# Altium schematic sheet Power.SchDoc
size C; SheetNumber: 3; SheetTotal: 15
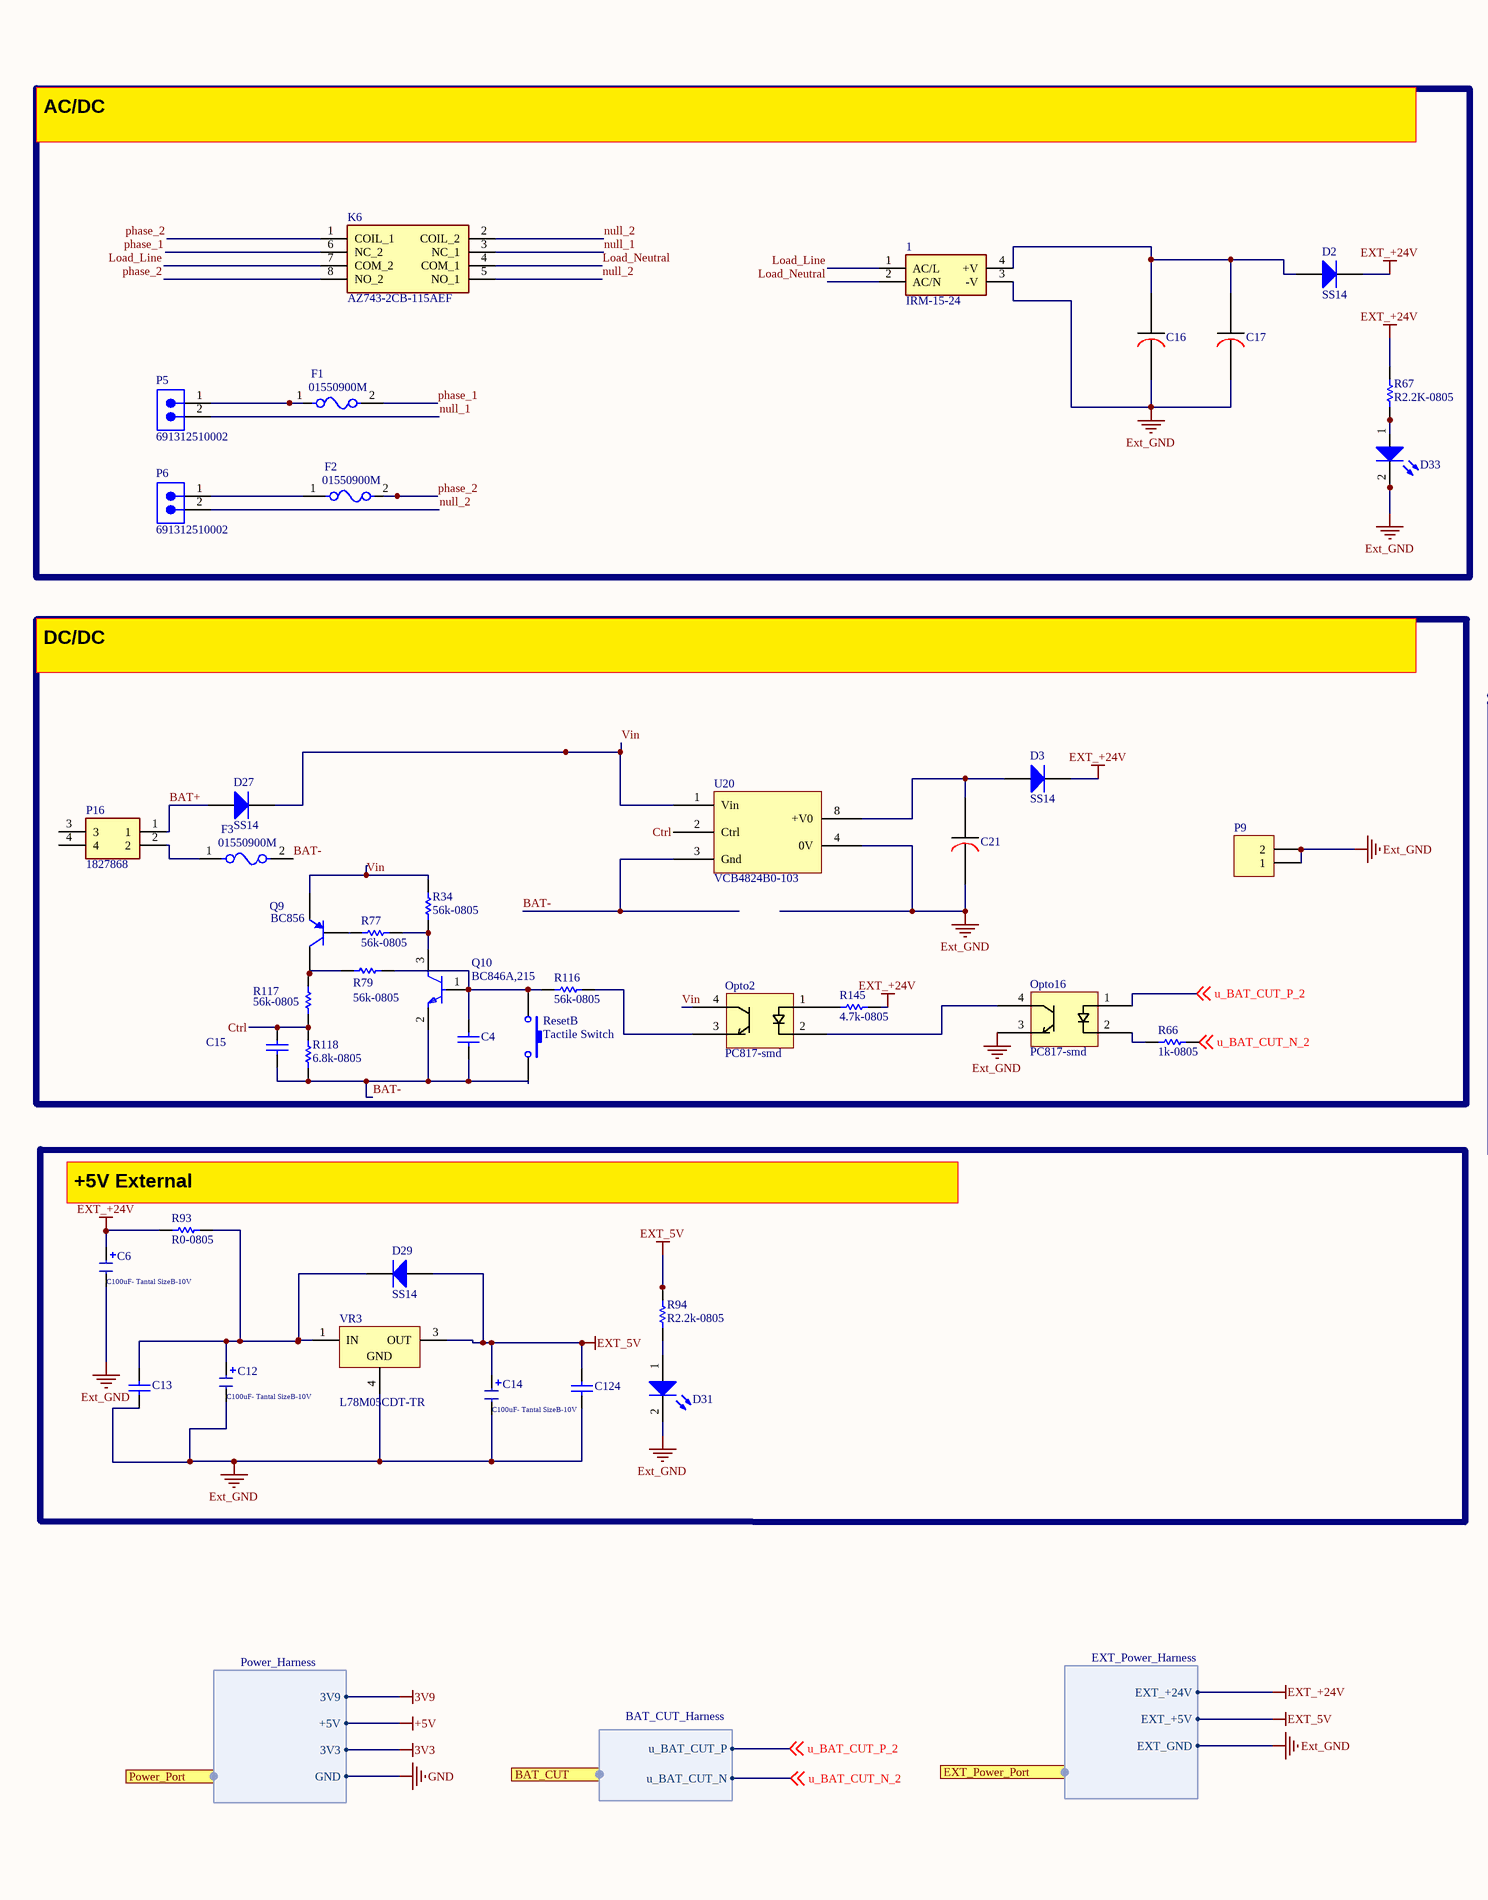
[diagram p0: Power.SchDoc, left]
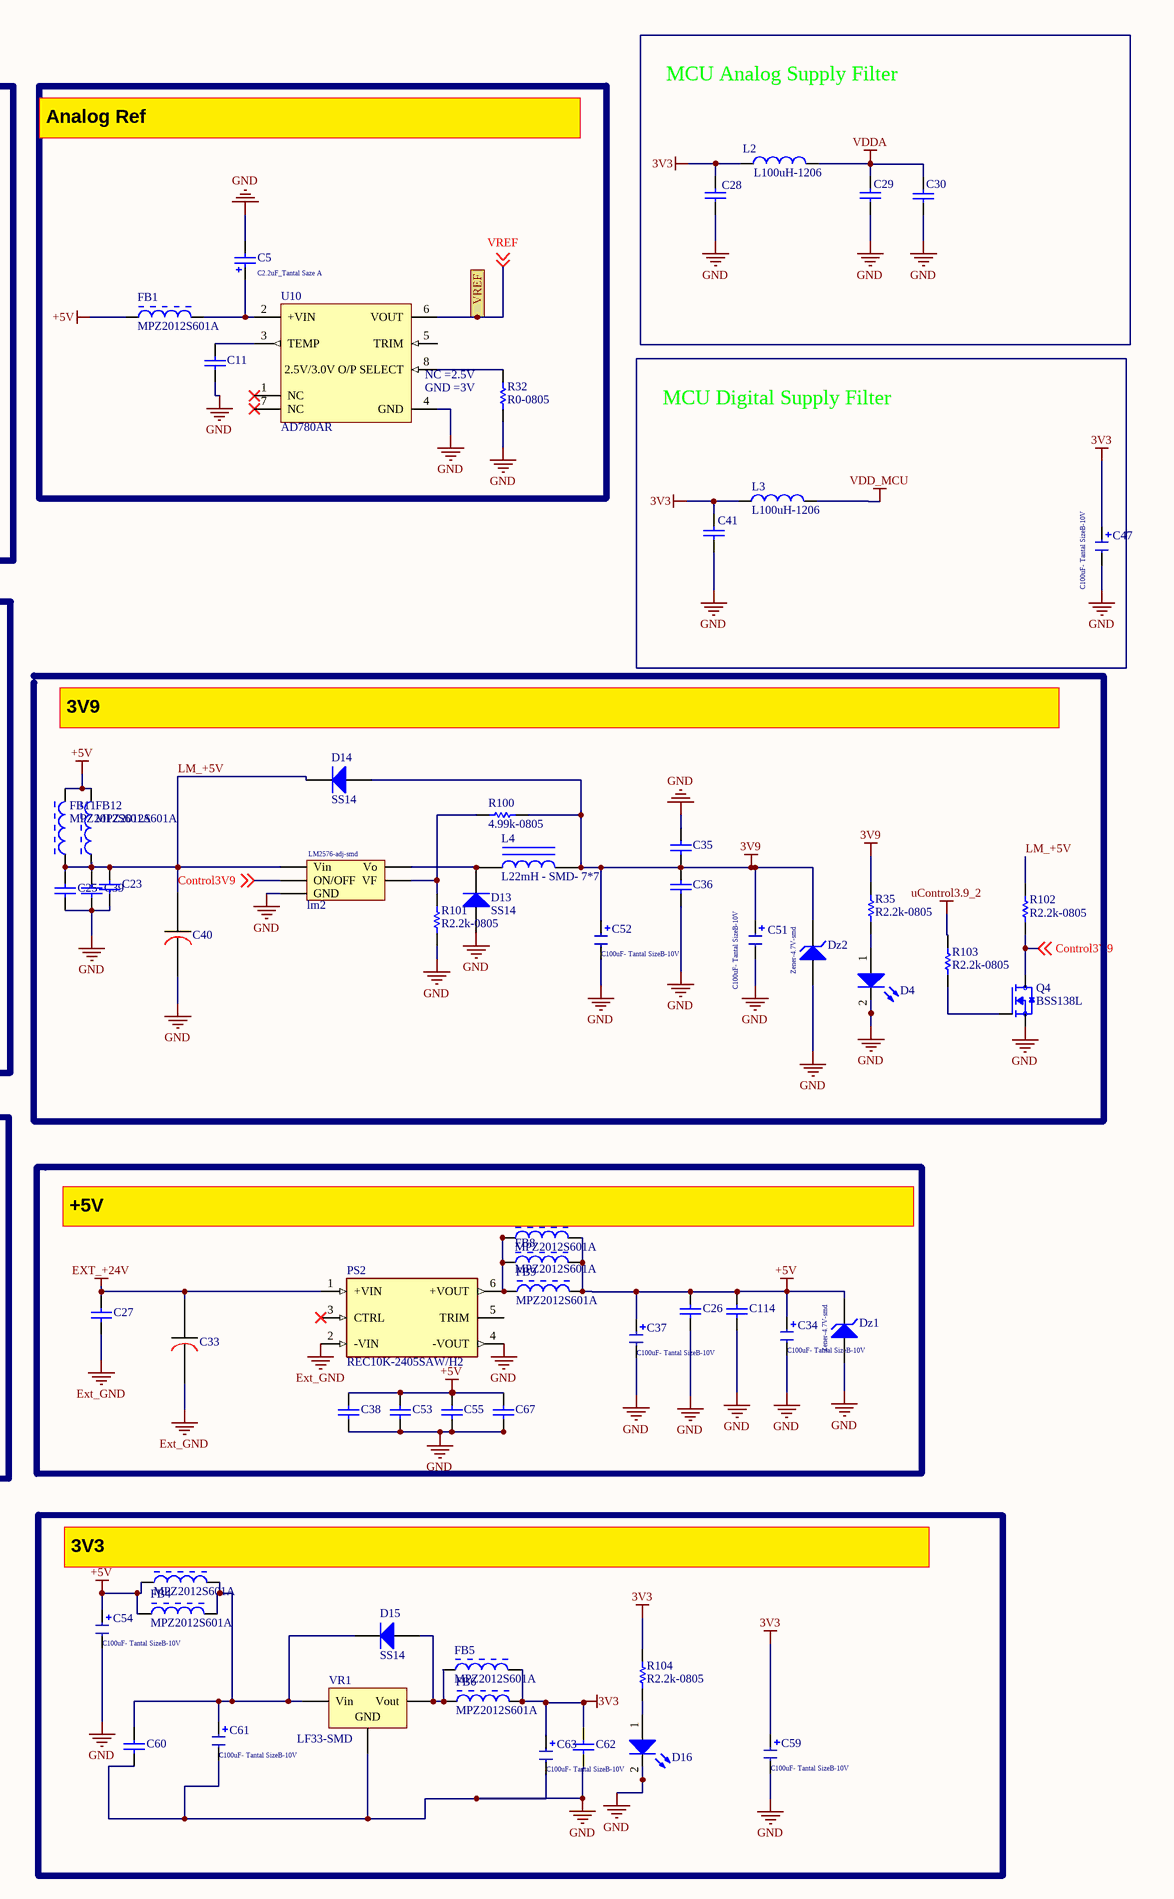
[diagram p1: Power.SchDoc, right]

## Parts
1  IRM-15-24  [IRM-15-5]
C4  (no value)  [CRF06031]
C5  C2.2uF_Tantal Saze A  [Tantalium Size A]
C6  C100uF- Tantal SizeB-10V  [Tantalium Size B]
C11  (no value)  [CRF06031]
C12  C100uF- Tantal SizeB-10V  [Tantalium Size B]
C13  (no value)  [CRF06031]
C14  C100uF- Tantal SizeB-10V  [Tantalium Size B]
C15  (no value)  [CRF06031]
C16  C100uF-50V  [CAPACITOR RADIAL SMT size F]  (value not drawn)
C17  C100uF-50V  [CAPACITOR RADIAL SMT size F]  (value not drawn)
C21  C100uF-50V  [CAPACITOR RADIAL SMT size F]  (value not drawn)
C23  (no value)  [CRF06031]
C25  (no value)  [CRF06031]
C26  (no value)  [CRF06031]
C27  (no value)  [CRF06031]
C28  (no value)  [CRF06031]
C29  (no value)  [CRF06031]
C30  (no value)  [CRF06031]
C33  C100uF-50V  [CAPACITOR RADIAL SMT size F]  (value not drawn)
C34  C100uF- Tantal SizeB-10V  [Tantalium Size B]
C35  (no value)  [CRF06031]
C36  (no value)  [CRF06031]
C37  C100uF- Tantal SizeB-10V  [Tantalium Size B]
C38  (no value)  [CRF06031]
C39  (no value)  [CRF06031]
C40  C100uF-50V  [CAPACITOR RADIAL SMT size F]  (value not drawn)
C41  (no value)  [CRF06031]
C47  C100uF- Tantal SizeB-10V  [Tantalium Size B]
C51  C100uF- Tantal SizeB-10V  [Tantalium Size B]
C52  C100uF- Tantal SizeB-10V  [Tantalium Size B]
C53  (no value)  [CRF06031]
C54  C100uF- Tantal SizeB-10V  [Tantalium Size B]
C55  (no value)  [CRF06031]
C59  C100uF- Tantal SizeB-10V  [Tantalium Size B]
C60  (no value)  [CRF06031]
C61  C100uF- Tantal SizeB-10V  [Tantalium Size B]
C62  (no value)  [CRF06031]
C63  C100uF- Tantal SizeB-10V  [Tantalium Size B]
C67  (no value)  [CRF06031]
C114  (no value)  [CRF06031]
C124  (no value)  [CRF06031]
D2  SS14  [ind]
D3  SS14  [ind]
D4  LED_0805_green  [0805-LED]  (value not drawn)
D13  SS14  [ind]
D14  SS14  [ind]
D15  SS14  [ind]
D16  LED_0805_green  [0805-LED]  (value not drawn)
D27  SS14  [ind]
D29  SS14  [ind]
D31  LED_0805_green  [0805-LED]  (value not drawn)
D33  LED_0805_green  [0805-LED]  (value not drawn)
Dz1  Zener-4.7V-smd  [ind]
Dz2  Zener-4.7V-smd  [ind]
F1  01550900M  [FP-0155-MFG]
F2  01550900M  [FP-0155-MFG]
F3  01550900M  [FP-0155-MFG]
FB1  MPZ2012S601A  [TDK-MPZ2012_V]
FB3  MPZ2012S601A  [TDK-MPZ2012_V]
FB4  MPZ2012S601A  [TDK-MPZ2012_V]
FB5  MPZ2012S601A  [TDK-MPZ2012_V]
FB6  MPZ2012S601A  [TDK-MPZ2012_V]
FB7  MPZ2012S601A  [TDK-MPZ2012_V]
FB8  MPZ2012S601A  [TDK-MPZ2012_V]
FB9  MPZ2012S601A  [TDK-MPZ2012_V]
FB11  MPZ2012S601A  [TDK-MPZ2012_V]
FB12  MPZ2012S601A  [TDK-MPZ2012_V]
K6  AZ743-2CB-115AEF  [AZ7432CB115AEF]
L2  L100uH-1206  [crf1206]
L3  L100uH-1206  [crf1206]
L4  L22mH - SMD- 7*7  [LM_810]
lm2  LM2576-adj-smd  [lm2576 - SMD]
Opto2  PC817-smd  [PC817_SMD1]
Opto16  PC817-smd  [PC817_SMD1]
P5  691312510002  [691312510002]
P6  691312510002  [691312510002]
P9  DNP  [HDR1X2]  (value not drawn)
P16  1827868  [1827868]
PS2  REC10K-2405SAW/H2  [CONV_REC10K-2405SAW/H2]
Q4  BSS138L  [BSS138L]
Q9  BC856  [NXP-SOT23-3_V]
Q10  BC846A,215  [FP-SOT23-MFG]
R32  R0-0805  [CRF06031]
R34  56k-0805  [CRF06031]
R35  R2.2k-0805  [CRF06031]
R66  1k-0805  [CRF06031]
R67  R2.2K-0805  [CRF06031]
R77  56k-0805  [CRF06031]
R79  56k-0805  [CRF06031]
R93  R0-0805  [CRF06031]
R94  R2.2k-0805  [CRF06031]
R100  4.99k-0805  [CRF06031]
R101  R2.2k-0805  [CRF06031]
R102  R2.2k-0805  [CRF06031]
R103  R2.2k-0805  [CRF06031]
R104  R2.2k-0805  [CRF06031]
R116  56k-0805  [CRF06031]
R117  56k-0805  [CRF06031]
R118  6.8k-0805  [CRF06031]
R145  4.7k-0805  [CRF06031]
ResetB  Tactile Switch  [CRF06031]
U10  AD780AR  [SOIC-8]
U20  VCB4824B0-103  [VCB4824SB0-10WR3]
VR1  LF33-SMD  [LM7805 - smd]
VR3  L78M05CDT-TR  [TO-252_L]

## Ports
BAT_CUT (harness BAT_CUT_Harness), EXT_Power_Port (harness EXT_Power_Harness), Power_Port (harness Power_Harness), VREF

## Harnesses
Power_Harness: 3V9, +5V, 3V3, GND
BAT_CUT_Harness: u_BAT_CUT_P, u_BAT_CUT_N
EXT_Power_Harness: EXT_+24V, EXT_+5V, EXT_GND

## Nets
3V3: C28.1 C41.1 C47.1 C59.1 C62.1 C63.1 FB5.2 FB6.2 L2.1 L3.1 R104.1 ; port Power_Port.3V3
3V9: C35.2 C36.2 C51.1 C52.1 D14.1(A) Dz2.2(K) L4.2 R35.1 R100.1 ; port Power_Port.3V9
+5V: C26.2 C34.1 C37.1 C38.1 C53.1 C54.1 C55.1 C67.1 C114.2 Dz1.2(K) FB1.1 FB3.1 FB4.1 FB7.2 FB8.2 FB9.2 FB11.2 FB12.2 ; port Power_Port.+5V
EXT_5V: C14.1 C124.1 D29.1(A) R94.1 VR3.3(OUT) ; port EXT_Power_Port.EXT_+5V
EXT_+24V: C6.1 C27.2 C33.1 D2.2(K) D3.2(K) PS2.1(+VIN) R67.1 R93.1 R145.1 ; port EXT_Power_Port.EXT_+24V
Ext_GND: 1.3(-V) C6.2 C12.2 C13.2 C14.2 C16.2 C17.2 C21.2 C27.1 C33.2 C124.2 D31.2(K) D33.2(K) Opto16.3 P9.1 P9.2 PS2.2(-VIN) U20.4(0V) VR3.4(GND) ; port EXT_Power_Port.EXT_GND
GND: C5.2 C11.2 C23.1 C25.1 C26.1 C28.2 C29.2 C30.2 C34.2 C35.1 C36.1 C37.2 C38.2 C39.1 C40.2 C41.2 C47.2 C51.2 C52.2 C53.2 C54.2 C55.2 C59.2 C60.2 C61.2 C62.2 C63.2 C67.2 C114.1 D4.2(K) D13.1(A) D16.2(K) Dz1.1(A) Dz2.1(A) lm2.3(GND) PS2.4(-VOUT) Q4.S R32.2 R101.2 U10.4(GND) VR1.2(GND) ; port Power_Port.GND
uControl3.9_2: R103.1
VDD_MCU: L3.2
VDDA: C29.1 C30.1 L2.2
BAT+: D27.1(A) P16.1
BAT-: C4.2 C15.2 F3.2 Q10.2(E) R118.1 ResetB.2 U20.3(Gnd)
Control3V9: lm2.5(ON/OFF) Q4.D R102.2 ; off-sheet Control3V9
Ctrl: C15.1 R117.1 R118.2 U20.2(Ctrl)
LM_+5V: C23.2 C25.2 C39.2 C40.1 D14.2(K) FB11.1 FB12.1 lm2.1(Vin) R102.1
Load_Line: 1.1(AC/L) K6.7(COM_2)
Load_Neutral: 1.2(AC/N) K6.4(COM_1)
null_1: K6.3(NC_1) P5.2
null_2: K6.2(COIL_2) K6.5(NO_1) P6.2
phase_1: F1.2 K6.6(NC_2)
phase_2: F2.2 K6.1(COIL_1) K6.8(NO_2)
u_BAT_CUT_N_2: R66.1 ; off-sheet u_BAT_CUT_N_2, port BAT_CUT.u_BAT_CUT_N
u_BAT_CUT_P_2: Opto16.1 ; off-sheet u_BAT_CUT_P_2, port BAT_CUT.u_BAT_CUT_P
Vin: D27.2(K) Opto2.4 Q9.2(E) R34.2 U20.1(Vin)
VREF: U10.6(VOUT) ; off-sheet VREF, port VREF
Net1_4: 1.4(+V) C16.1 C17.1 D2.1(A)
NetC4_1: C4.1 Q10.1(B) R79.1 R116.2 ResetB.1
NetC5_1: C5.1 FB1.2 U10.2(+VIN)
NetC11_1: C11.1 U10.3(TEMP)
NetC12_1: C12.1 C13.1 D29.2(K) R93.2 VR3.1(IN)
NetC21_1: C21.1 D3.1(A) U20.8(+V0)
NetC60_1: C60.1 C61.1 D15.2(K) FB3.2 FB4.2 VR1.1(Vin)
NetD4_1: D4.1(A) R35.2
NetD13_2: D13.2(K) L4.1 lm2.2(Vo)
NetD15_1: D15.1(A) FB5.1 FB6.1 VR1.3(Vout)
NetD16_1: D16.1(A) R104.2
NetD31_1: D31.1(A) R94.2
NetD33_1: D33.1(A) R67.2
NetF1_1: F1.1 P5.1
NetF2_1: F2.1 P6.1
NetF3_1: F3.1 P16.2
NetFB7_1: FB7.1 FB8.1 FB9.1 PS2.6(+VOUT)
Netlm2_4: lm2.4(VF) R100.2 R101.1
NetOpto2_1: Opto2.1 R145.2
NetOpto2_2: Opto2.2 Opto16.4
NetOpto2_3: Opto2.3 R116.1
NetOpto16_2: Opto16.2 R66.2
NetQ4_G: Q4.G R103.2
NetQ9_1: Q9.1(B) R77.2
NetQ9_3: Q9.3(C) R79.2 R117.2
NetQ10_3: Q10.3(C) R34.1 R77.1
NetR32_1: R32.1 U10.8(2.5V/3.0V_O/P_SELECT)

Not connected (* = marked no-connect by the designer): P16 3 4; PS2 3(CTRL)* 5(TRIM); U10 1(NC)* 5(TRIM) 7(NC)*

## Notes on the sheet
- AC/DC
- Analog Ref
- MCU Analog Supply Filter
- (near U10) NC =2.5V
- (near U10) GND =3V
- MCU Digital Supply Filter
- DC/DC
- 3V9
- (near R93) +5V External
- (near FB7) +5V
- (near FB3) 3V3

## Library data of the parts
1 = IRM-15-24: Power Supply; Manufacturer_Name: Mean Well; Manufacturer_Part_Number: IRM-15-24; Mouser Part Number: 709-IRM15-24; Arrow Part Number: IRM-15-24; Digi-Key_Part_Number: 1866-3035-ND; Manufacturer_P/N: IRM-15-24; JLC P/N: C7211221
C4 C11 C13 C15 C23 C25-C30 C35 C36 C38 C39 C41 C53 C55 C60 C62 C67 C114 C124 = Cap: Capacitor; Manufacturer_P/N: GCM21BR72A104KA37L; Digi-Key_Part_Number: 490-4789-1-ND; JLC P/N: C85866
  C4 C15: ClassName: BAT/24
  C11: ClassName: AnalogRef
  C13 C124: ClassName: 5V External
  C23 C25 C35 C36 C39: ClassName: Sim7600
  C27: ClassName: Iso_5v
  C60 C62: ClassName: 3v3
C5 = Cap_10uF_POL_10%_TANA: Polarized Capacitor,2.2uF,10VtypeA; Manuf_1: VISHAY; Manuf_Part_1: 293D106X9010A2TE3; Manufacturer_P/N: 293D225X0016A2TE3; Revision: July-2002: Re-released for DXP Platform.; ClassName: AnalogRef; Digi-Key_Part_Number: 718-2135-2-ND; JLC P/N: C1954029
C6 C12 C14 C34 C37 C47 C51 C52 C54 C59 C61 C63 = Capacitor Tantalium: Manufacturer_P/N: TMCMB1A107MTRF; JLC P/N: C4986978
  C6: ClassName: 5V External; Digi-Key_Part_Number: 718-2425-2-ND
  C12 C14: ClassName: 5V External; Digi-Key_Part_Number: 718-2425-1-ND
  C34: Digi-Key_Part_Number: 718-2425-1-ND
  C37 C47: Digi-Key_Part_Number: 718-2425-2-ND
  C51 C52: ClassName: Sim7600; Digi-Key_Part_Number: 718-2425-2-ND
  C54 C59 C61 C63: ClassName: 3v3; Digi-Key_Part_Number: 718-2425-2-ND
C16 C17 C21 C33 C40 = CAP_E_SMD: SMD_Electrolyt; Manufacturer_P/N: EEE-HD1H101P; Digi-Key_Part_Number: PCE4980CT-ND; JLC P/N: C401850
  C16 C17: ClassName: AC/DC
  C21: ClassName: BAT/24
  C33: ClassName: Iso_5v
  C40: ClassName: Sim7600
D2 D3 D13-D15 D27 D29 = Diode: Default Diode; Digi-Key_Part_Number: SS14TR-ND; Manufacturer_P/N: SS14
  D2: ClassName: AC/DC
  D13 D14: ClassName: Sim7600
  D15: ClassName: 3v3
  D27: ClassName: BAT/24
  D29: ClassName: 5V External
D4 D16 D31 D33 = LED_0805: Manufacturer_P/N: NCD0805R1; JLC P/N: C84256
  D4: ClassName: Sim7600
  D16: ClassName: 3v3
  D31: ClassName: 5V External
Dz1 Dz2 = D Zener: Zener Diode; Manufacturer_P/N: MM3Z4V7ST1G; Digi-Key_Part_Number: MM3Z4V7ST1GOSTR-ND; JLC P/N: C154578
  Dz1: ClassName: Iso_5v
  Dz2: ClassName: Sim7600
F1-F3 = CMP-08604-000021-1: FUSE BLOK CARTRIDGE 125V 10A SMD; Octopart: https://octopart.com/01550900m-littelfuse-9291575; Digikey Description: FUSE BLOK CARTRIDGE 125V 10A SMD; Manufacturer Part Number: 01550900M; Mouser Description: Fuse Holder ACS NANO HLDR; Digi-Key_Part_Number: F1889-ND; Manufacturer_P/N: 01550900M; JLC P/N: C108518
FB1 FB3-FB9 FB11 FB12 = CMP-2000-05400-1: Chip Bead for Power Line, 600 Ohm, +/- 25%, 2 A, -55 to 125 degC, 2-Pin SMD (0805), RoHS, Tape and Reel; Manufacturer_P/N: MPZ2012S601AT000; Maximum DC Current: 2A; Maximum DC Resistance: 100mOhms; Manufacturer URL: http://www.tdk.com/; Product: FerriteChipBeads; Digi-Key_Part_Number: 445-MPZ2012S601AT000TR-ND; JLC P/N: C21519
  FB3-FB6: ClassName: 3v3
  FB7-FB9: ClassName: Iso_5v
  FB11 FB12: ClassName: Sim7600
K6 = AZ743-2CB-115AEF: Relay or Contactor; Manufacturer_Name: Zettler Group; Manufacturer_Part_Number: AZ743-2CB-115AEF; Digi-Key_Part_Number: 3385-AZ743-2CB-115AEF-ND; Manufacturer_P/N: AZ743-2CB-115AEF; JLC P/N: C20260853
L2 L3 = Inductor: Manufacturer_P/N: CBC3225T101MR; Digi-Key_Part_Number: 587-1628-2-ND; JLC P/N: C90316
L4 = Inductor Iron: Magnetic-Core Inductor; Manufacturer_P/N: SRR7045-220M; ClassName: Sim7600; Digi-Key_Part_Number: SRR7045-220MTR-ND; JLC P/N: C1332212
lm2 = LM2576: Manufacturer_P/N: LM2576SX-ADJ/NOPB; ClassName: Sim7600; Digi-Key_Part_Number: LM2576SX-ADJ/NOPBTR-ND; JLC P/N: C12619
Opto2 Opto16 = PC817: Manufacturer_P/N: APC-817D1-SL; Digi-Key_Part_Number: 2007-APC-817D1-SLTR-ND; JLC P/N: C17448553
  Opto2: ClassName: BAT/24
P5 P6 = CMP-1502-02169-2: Mount: Through Hole; Digi-Key_Part_Number: 732-2064-ND; Manufacturer_P/N: 691312510002; JLC P/N: C5439729
P9 = Header 2: ClassName: AC/DC
P16 = 1827868: Connector; Manufacturer_Name: Phoenix Contact; Manufacturer_Part_Number: 1827868; Mouser Part Number: 651-1827868; Arrow Part Number: 1827868; Digi-Key_Part_Number: 277-5745-ND; Manufacturer_P/N: 1827868; JLC P/N: C3585934
PS2 = REC10K-2405SAW/H2: 10W DC/DC-Converter 'ECONOLINE' 1x1 1.6kV reg 4:1; MF: Recom Power; MP: REC10K-2405SAW/H2; ClassName: Iso_5v; Digi-Key_Part_Number: 945-REC10K-2405SAW/H2-ND; Manufacturer_P/N: REC10K-2405SAW/H2
Q4 = BSS138L: N-Channel 50V 200mA _Ta_ 350mW _Ta_ Surface Mount SOT-23-3; MF: ON Semiconductor; MP: BSS138L; ClassName: Sim7600; Digi-Key_Part_Number: BSS138LTR-ND; Manufacturer_P/N: BSS138L; JLC P/N: C890265
Q9 = CMP-2000-05936-1: PNP General Purpose Transistor, 65 V, -65 to 150 degC, 3-Pin SOT23, RoHS; Manufacturer_P/N: BC856C; SVHC: NoSVHC(19-Dec-2012); Manufacturer URL: http://www.nxp.com/; Digi-Key_Part_Number: 4878-BC856CTR-ND; JLC P/N: C181145
Q10 = CMP-14406-000010-1: TRANS NPN 65V 0.1A SOT23; Temperature: to +150°C; Octopart: https://octopart.com/bc846a%2C215-nexperia-78739089; Digikey Description: TRANS NPN 65V 0.1A SOT23; Manufacturer Part Number: BC846A,215; Ambient Temperature Range Low: -65°C; Mouser Description: BC846 Series 65 V 100 mA NPN SMT General Purpose Transistor - SOT-23; Ambient Temperature Range High: +150°C; Digi-Key_Part_Number: 1727-4239-2-ND; Manufacturer_P/N: BC846A,215; JLC P/N: C90281
R32 R93 = Res1: Resistor; Manufacturer_P/N: RC0805FR-070RL; Digi-Key_Part_Number: 311-0.0CRTR-ND; JLC P/N: C100045
  R32: ClassName: AnalogRef
  R93: ClassName: 5V External
R34 R77 R79 R116 R117 = Res1: Resistor; Manufacturer_P/N: RC0805FR-0756KL; ClassName: BAT/24; Digi-Key_Part_Number: 311-56.0KCRTR-ND; JLC P/N: C137509
R35 R67 R94 R101-R104 = Res1: Resistor; Manufacturer_P/N: RC0805FR-072K2L; Digi-Key_Part_Number: 311-2.20KCRTR-ND; JLC P/N: C114561
  R35 R101-R103: ClassName: Sim7600
  R94: ClassName: 5V External
  R104: ClassName: 3v3
R66 = Res1: Resistor; Manufacturer_P/N: RC0805FR-071KL; Digi-Key_Part_Number: 311-1.00KCRTR-ND; JLC P/N: C95781
R100 R145 = Res1: Resistor; Manufacturer_P/N: RC0805FR-074K7L; Digi-Key_Part_Number: 311-4.70KCRTR-ND; JLC P/N: C60816
  R100: ClassName: Sim7600
  R145: ClassName: BAT/24
R118 = Res1: Resistor; Manufacturer_P/N: RC0805FR-076K8L; ClassName: BAT/24; Digi-Key_Part_Number: 311-6.80KCRTR-ND; JLC P/N: C114550
ResetB = Switch PB: Manufacturer_P/N: 430152043836; Digi-Key_Part_Number: 732-6992-2-ND; JLC P/N: C6687535
U10 = AD780AR: High Precision Reference, 2.5 or 3 V Output, 4 to 36 V Supply, Industrial, 8-pin SOIC (R-8), Tube; Manufacturer_P/N: AD780ARZ; Max V Supply (V): 36; Min V Supply (V): 4; Supplier 1: Digi-Key; Supplier Part Number 1: AD780AR-ND; Supplier 2: Mouser; Supplier Part Number 2: 584-AD780AR; PartNumber: AD780AR; ClassName: AnalogRef; Digi-Key_Part_Number: 505-AD780ARZ-ND; JLC P/N: C578527
U20 = VCB4824B0-103: Manufacturer_P/N: VCB4824SBO-10WR3; ClassName: BAT/24; Digi-Key_Part_Number: 2725-VCB4824SBO-10WR3-ND
VR1 = Volt Reg: Voltage Regulator (LF33); Manufacturer_P/N: LF33CDT-TR; ClassName: 3v3; Digi-Key_Part_Number: 497-1532-2-ND; JLC P/N: C222179
VR3 = CMP-0244-00178-1: Positive Voltage Regulator, 5V, 3-Pin DPAK, Tape and Reel; ClassName: 5V External; Digi-Key_Part_Number: 497-1203-2-ND; Manufacturer_P/N: L78M05CDT-TR; JLC P/N: C55509